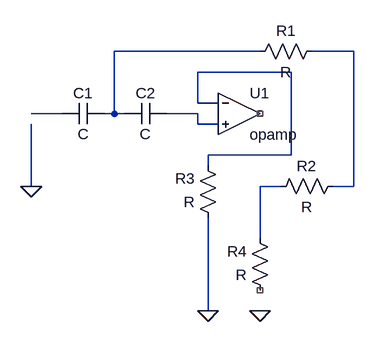
[diagram p0: schematic high pass.asc]
high pass.asc, the LTspice schematic file:
Version 4
SHEET 1 880 680
WIRE 304 0 80 0
WIRE 448 0 384 0
WIRE 352 32 208 32
WIRE 208 80 208 32
WIRE 240 80 208 80
WIRE 0 96 -48 96
WIRE 80 96 80 0
WIRE 80 96 64 96
WIRE 96 96 80 96
WIRE 208 96 160 96
WIRE 208 112 208 96
WIRE 240 112 208 112
WIRE 352 160 352 32
WIRE 352 160 224 160
WIRE 224 176 224 160
WIRE -48 208 -48 112
WIRE 336 208 304 208
WIRE 448 208 448 0
WIRE 448 208 416 208
WIRE 304 288 304 208
WIRE 224 400 224 256
FLAG -48 208 0
FLAG 224 400 0
FLAG 304 400 0
SYMBOL cap 64 80 R90
WINDOW 0 0 32 VBottom 2
WINDOW 3 32 32 VTop 2
SYMATTR InstName C1
SYMBOL cap 160 80 R90
WINDOW 0 0 32 VBottom 2
WINDOW 3 32 32 VTop 2
SYMATTR InstName C2
SYMBOL res 400 -16 R90
WINDOW 0 0 56 VBottom 2
WINDOW 3 32 56 VTop 2
SYMATTR InstName R1
SYMBOL res 432 192 R90
WINDOW 0 0 56 VBottom 2
WINDOW 3 32 56 VTop 2
SYMATTR InstName R2
SYMBOL res 240 272 R180
WINDOW 0 36 76 Left 2
WINDOW 3 36 40 Left 2
SYMATTR InstName R3
SYMBOL res 320 384 R180
WINDOW 0 36 76 Left 2
WINDOW 3 36 40 Left 2
SYMATTR InstName R4
SYMBOL OpAmps\\opamp 272 32 R0
SYMATTR InstName U1

The netlist it stands for:
* high pass.asc
C1 N001 N004 C
C2 N005 N001 C
R1 N002 N001 R
R2 N002 N006 R
R3 0 N003 R
R4 NC_01 N006 R
XU1 N003 N005 NC_02 opamp Aol=100K GBW=10Meg  ; pins invin noninvin out
.backanno
.end